# Altium project OBDH_Ed02.PrjPcb
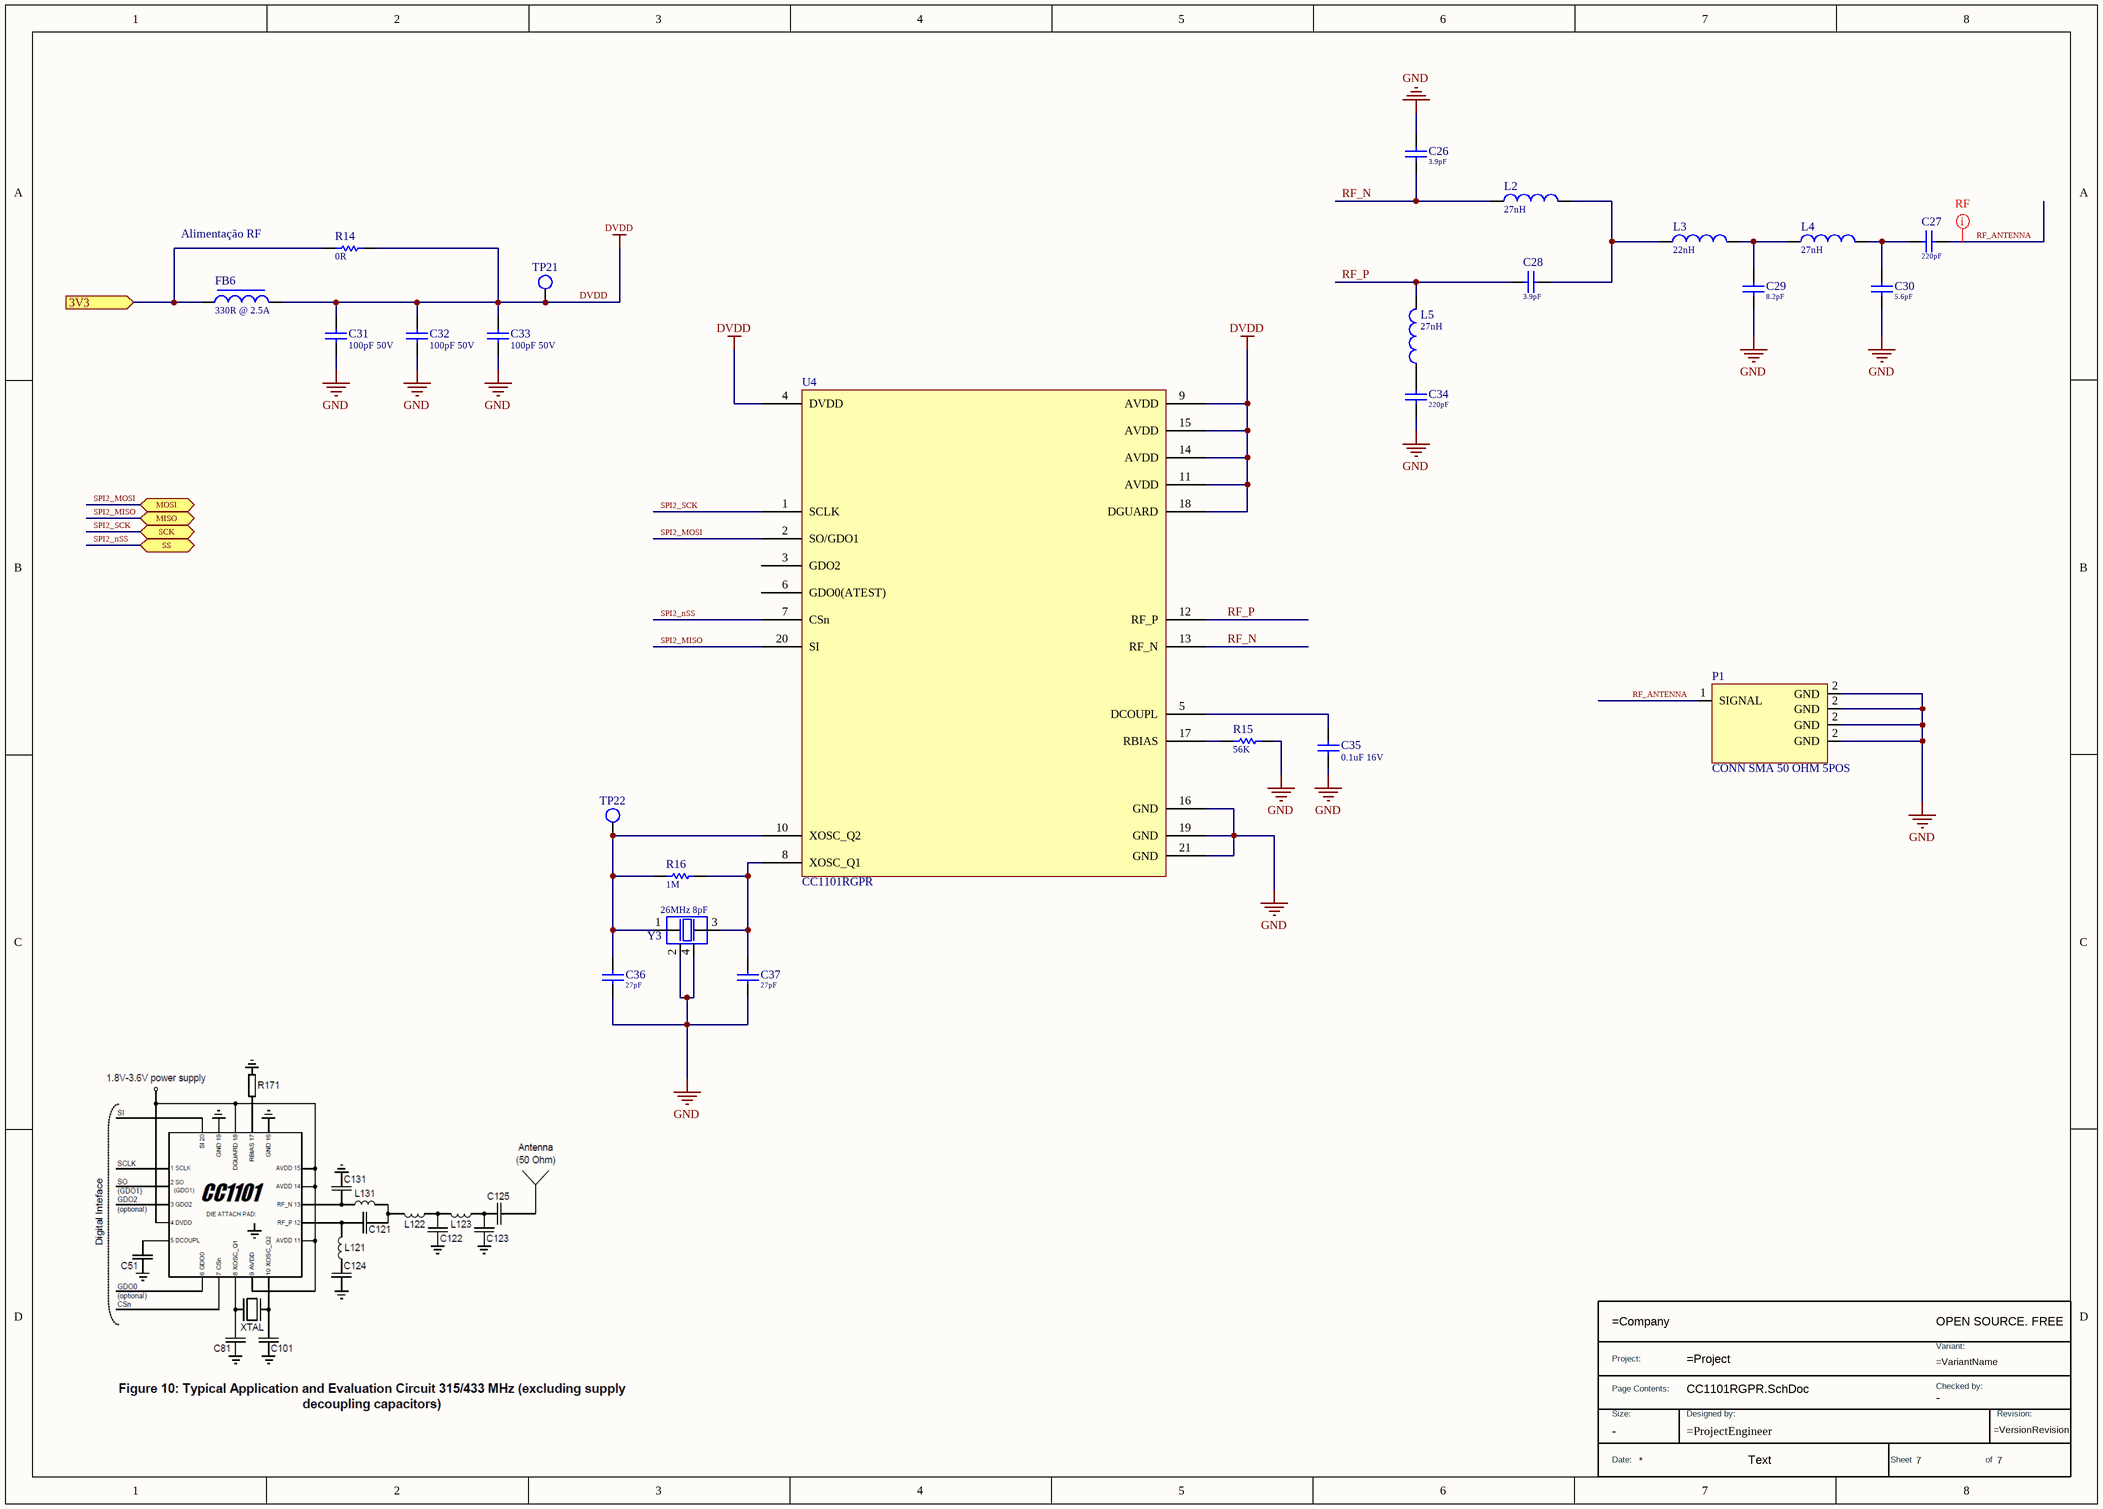
[diagram p0: CC1101RGPR.SchDoc]
1 sheet, 26 parts. Net scope: flat (ports and power ports of the same name join across sheets).
Board file: OBDH_Ed02.PcbDoc

## Sheet CC1101RGPR.SchDoc
size A3; SheetNumber: 7; SheetTotal: 7

### Parts
*  TitleBlock  (value not drawn)  (graphical)
C26  Valor: 3.9pF  [CAP 0402]  (hidden comment: GJM1555C1H3R9WB01D)
C27  Valor: 220pF  [CAP 0402]  (hidden comment: GRM155R71H221JA01D)
C28  Valor: 3.9pF  [CAP 0402]  (hidden comment: GJM1555C1H3R9WB01D)
C29  Valor: 8.2pF  [CAP 0402]  (hidden comment: GCM1555C1H8R2CA16D)
C30  Valor: 5.6pF  [CAP 0402]  (hidden comment: GRM1555C1H5R6CA01D)
C31  Valor: 100pF 50V  [CAP_0805]  (hidden comment: CC0805JRNPO9BN101)
C32  Valor: 100pF 50V  [CAP_0805]  (hidden comment: CC0805JRNPO9BN101)
C33  Valor: 100pF 50V  [CAP_0805]  (hidden comment: CC0805JRNPO9BN101)
C34  Valor: 220pF  [CAP 0402]  (hidden comment: GRM155R71H221JA01D)
C35  Valor: 0.1uF 16V  [CAP_0805]  (hidden comment: CL05B104KO5NNNC)
C36  Valor: 27pF  [CAP 0402]  (hidden comment: GCM1555C1H270JA16D)
C37  Valor: 27pF  [CAP 0402]  (hidden comment: GCM1555C1H270JA16D)
FB6  Valor: 330R @ 2.5A  [IND_0805]  (hidden comment: MPZ2012S331AT000)
L2  value 27nH  [IND 0402]  (hidden comment: LQG15HS27NH02D)
L3  value 22nH  [IND 0402]  (hidden comment: LQG15HN22NH02D)
L4  value 27nH  [IND 0402]  (hidden comment: LQG15HS27NH02D)
L5  value 27nH  [IND 0402]  (hidden comment: LQG15HS27NH02D)
P1  CONN SMA 50 OHM 5POS  [CONN PTH SMA JACK CONSMA002-L-G]
R14  Valor: 0R  [RES_0805]  (hidden comment: RC0805JR-070RL)
R15  Valor: 56K  [RES_0805]  (hidden comment: **CRCW080562K0JNEA)
R16  Valor: 1M  [RES 0402]  (hidden comment: CRCW08051M00JNEA)
TP21  TEST_POINT_1.5MM  [TESTPOINT_1.5MM]  (value not drawn)  (no BOM)
TP22  TEST_POINT_1.5MM  [TESTPOINT_1.5MM]  (value not drawn)  (no BOM)
U4  CC1101RGPR  [QLP-4x4]
Y3  Valor: 26MHz 8pF  [Crystal-4SMD]  (hidden comment: NX3225SA-26MHZ)

### Ports
3V3 (in, see BLOCO PRINCIPAL[6D], INTERFACE_EXT[1B], LSM6DSOTR[1A], ST1S40IDR[8B], STM32L412CBU6[1A]), MISO (bidir, see BLOCO PRINCIPAL[6D], STM32L412CBU6[8B]), MOSI (bidir, see BLOCO PRINCIPAL[6D], STM32L412CBU6[8B]), SCK (bidir, see BLOCO PRINCIPAL[6D], STM32L412CBU6[8B]), SS (bidir, see BLOCO PRINCIPAL[6D], STM32L412CBU6[8B])

### Nets
DVDD: C31.2 C32.2 C33.2 FB6.2 R14.2 TP21.1 U4.4(DVDD) U4.9(AVDD) U4.11(AVDD) U4.14(AVDD) U4.15(AVDD) U4.18(DGUARD)
GND: C26.2 C29.2 C30.1 C31.1 C32.1 C33.1 C34.1 C35.1 C36.1 C37.1 P1.2(GND) R15.2 U4.16(GND) U4.19(GND) U4.21(GND) Y3.2 Y3.4
RF_ANTENNA: C27.2 P1.1(SIGNAL)
RF_N: C26.1 L2.1 U4.13(RF_N)
RF_P: C28.1 L5.2 U4.12(RF_P)
SPI2_MISO: U4.20(SI) ; port MISO
SPI2_MOSI: U4.2(SO/GDO1) ; port MOSI
SPI2_nSS: U4.7(CSn) ; port SS
SPI2_SCK: U4.1(SCLK) ; port SCK
NetC27_1: C27.1 C30.2 L4.2
NetC28_2: C28.2 L2.2 L3.1
NetC29_1: C29.1 L3.2 L4.1
NetC34_2: C34.2 L5.1
NetC35_2: C35.2 U4.5(DCOUPL)
NetC36_2: C36.2 R16.1 TP22.1 U4.10(XOSC_Q2) Y3.1
NetC37_2: C37.2 R16.2 U4.8(XOSC_Q1) Y3.3
NetFB6_1: FB6.1 R14.1 ; port 3V3
NetR15_1: R15.1 U4.17(RBIAS)

Not connected (* = marked no-connect by the designer): U4 3(GDO2) 6(GDO0(ATEST))

### Layout directives
net class RF: RF_ANTENNA

### Notes on the sheet
- Alimentação RF
- Todas as informações e detalhes técnicos deste documento são de inteira propriedade da empresa V2COM,
- não poderão ser copiados, reduzidos ou cedidos a terceiros sem prévia autorização por escrito da mesma.
- Salvo em (D/M/A):
- Página:
- de
- Nome do Projeto:
- https://v2com.com/
- Ed.:
- Responsável:
- Nome da página:
- Rev.:
- Projetista:
- Obs.:
- Revisor:
- Arquivo:
- -
- (in symbol TitleBlock) OPEN SOURCE. FREE; Project:; Variant:; Page Contents:; Checked by:; Size:; Designed by:; Revision:; Date:; Text; Sheet; of

### Library data of the parts
* = TitleBlock: Standard Title Block; DWG NO: =ProjectEngineer; Size: -; Checked by: -
C26 C28 = GJM1555C1H3R9WB01D: CAP CER 3.9PF 50V C0G/NP0 0402; Manufacturer: Murata Electronics; Case/Package: 0402; Manufacturer Part Number: GJM1555C1H3R9WB01D; Origem: *; Observação: *
C27 C34 = GRM155R71H221JA01D: CAP CER 220PF 50V X7R 0402; Manufacturer: Murata Electronics; Case/Package: 0402; Manufacturer Part Number: GRM155R71H221JA01D; Origem: *; Observação: *
C29 = GCM1555C1H8R2CA16D: CAP CER 8.2PF 50V C0G/NP0 0402; Manufacturer: Murata Electronics; Case/Package: 0402; Manufacturer Part Number: GCM1555C1H8R2CA16D; Origem: *; Observação: *
C30 = GRM1555C1H5R6CA01D: CAP CER 5.6PF 50V C0G/NP0 0402; Manufacturer: Murata Electronics; Case/Package: 0402; Manufacturer Part Number: GRM1555C1H5R6CA01D; Origem: *; Observação: *
C31-C33 = CC0805JRNPO9BN101: CAP CER 100PF 50V C0G/NPO 0805; Manufacturer: YAGEO; Origem: OBDH_Ed02; Case/Package: 0805; Manufacturer Part Number: CC0805JRNPO9BN101; Observação: *
C35 = CL05B104KO5NNNC: CAP CER 0.1UF 16V X5R 0805; Manufacturer: Samsung Electro-Mechanics; Origem: OBDH_Ed02; Case/Package: 0805; Manufacturer Part Number: CL05B104KO5NNNC; Observação: *
C36 C37 = GCM1555C1H270JA16D: CAP CER 27PF 50V C0G/NP0 0402; Manufacturer: Murata Electronics; Case/Package: 0402; Manufacturer Part Number: GCM1555C1H270JA16D; Origem: *; Observação: *
FB6 = MPZ2012S331AT000: FERRITE BEAD 330 OHM 0805 1LN; Manufacturer: TDK Corporation; Case/Package: 0805; Manufacturer Part Number: MPZ2012S331AT000; Origem: *; Observação: *
L2 L4 L5 = LQG15HS27NH02D: FIXED IND 27NH 350MA 460MOHM SMD; Manufacturer: Murata Electronics; Case/Package: 0402; Manufacturer Part Number: LQG15HS27NH02D; Origem: *; Observação: *
L3 = LQG15HN22NH02D: FIXED IND 22NH 350MA 580MOHM SMD; Manufacturer: Murata Electronics; Case/Package: 0402; Manufacturer Part Number: LQG15HN22NH02D; Origem: *; Observação: *
P1 = CONN SMA 50 OHM 5POS: CONN SMA JACK R/A 50OHM PCB
R14 = RC0805JR-070RL: RES 0 OHM JUMPER 1/8W 0805; Manufacturer: YAGEO; Case/Package: 0805; Manufacturer Part Number: RC0805JR-070RL; Origem: *; Observação: *
R15 = **CRCW080562K0JNEA: RES SMD 56K OHM 5% 1/8W 0805; Manufacturer: YAGEO; Case/Package: 0805; Manufacturer Part Number: CRCW080562K0JNEA; Origem: *; Observação: *
R16 = CRCW08051M00JNEA: RES SMD 1M OHM 5% 1/8W 0805; Manufacturer: Vishay Intertech; Case/Package: 0805; Manufacturer Part Number: CRCW08051M00JNEA; Origem: *; Observação: *
TP21 TP22 = TEST_POINT_1.5MM: TEST_POINT; Origem: -; Case/Package: SMD; Manufacturer: -; Manufacturer Part Number: TEST_POINT; Observação: *; Valor: *
U4 = CC1101RGPR: IC RF TXRX ISM<1GHZ 20VFQFN; Case/Package: *; Manufacturer: *; Manufacturer Part Number: *; Origem: *; Observação: *; Valor: *
Y3 = NX3225SA-26MHZ: CRYSTAL 26.0000MHZ 10PF SMD; Manufacturer: NDK America, Inc.; Manufacturer Part Number: NX3225SA-26MHZ; Observação: *

## Assembly variants
Variant of OBDH_Ed02: not fitted R4 R5 R6 R10 R11 R14 R16